# Altium schematic sheet Holder_Accu_Simetric.SchDoc
size A4; SheetNumber: 1; SheetTotal: 1
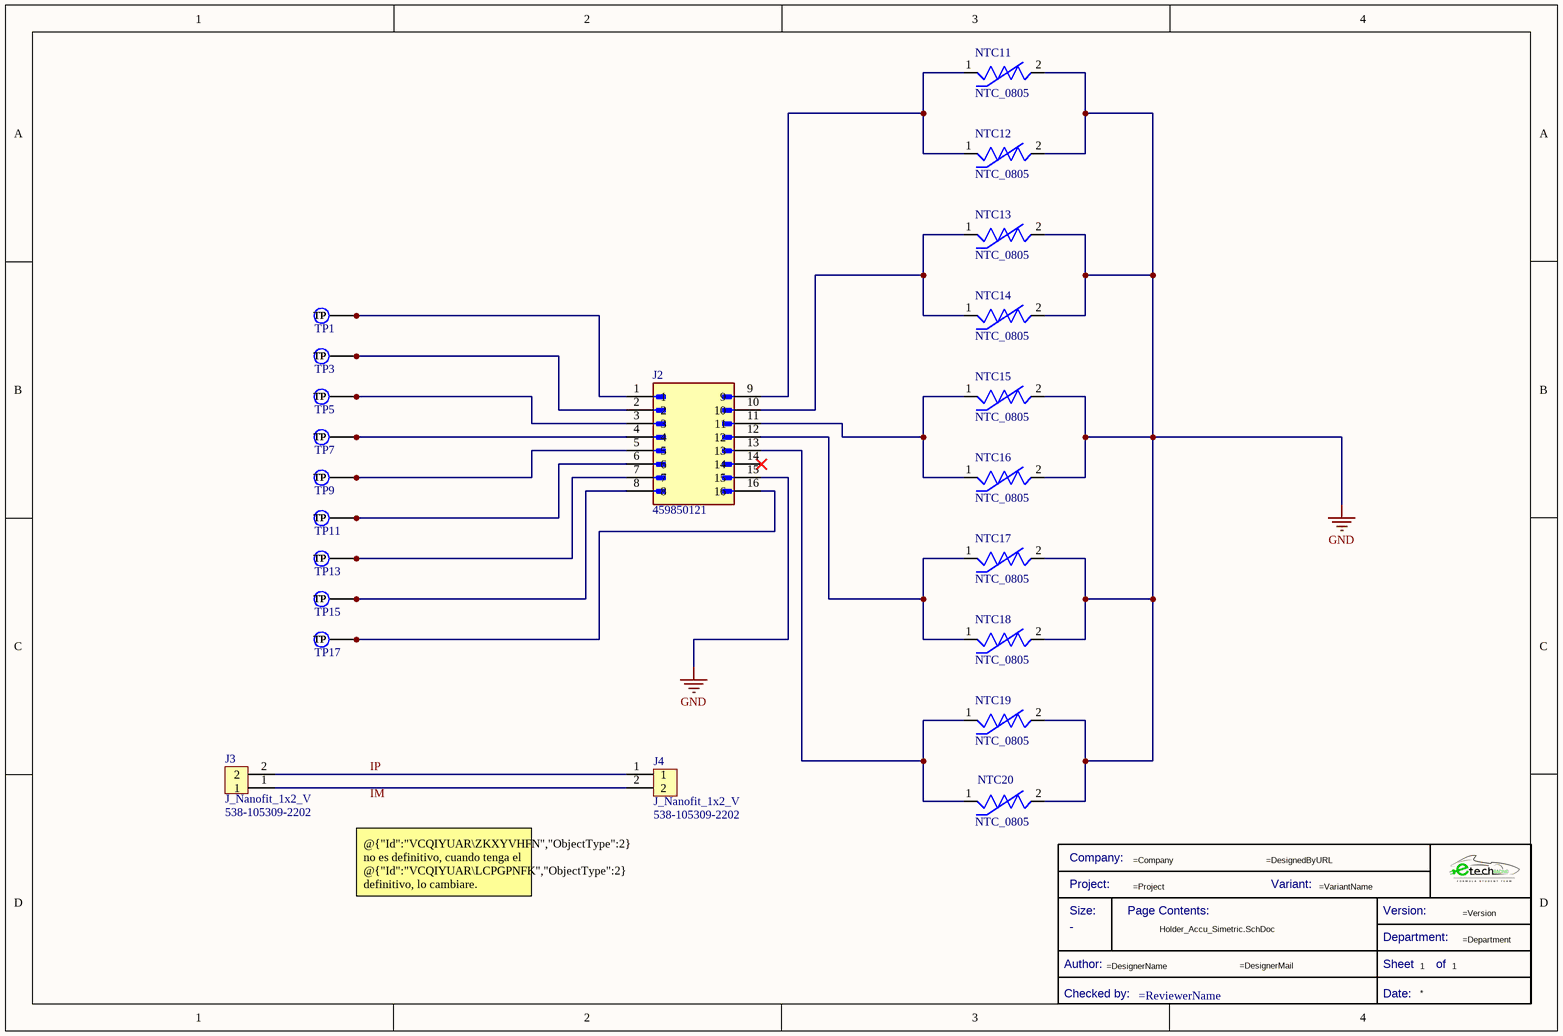
[diagram p0: Holder_Accu_Simetric.SchDoc]

## Parts
*  Title Block_template  (value not drawn)  (graphical)
J2  459850121  [MOLEX_459850121]
J3  J_Nanofit_1x2_V  Supplier Part Number 1: 538-105309-2202  [J_NanoFit_1X2_V]
J4  J_Nanofit_1x2_V  Supplier Part Number 1: 538-105309-2202  [J_NanoFit_1X2_V]
NTC11  NTC_0805  [NTC_0805]
NTC12  NTC_0805  [NTC_0805]
NTC13  NTC_0805  [NTC_0805]
NTC14  NTC_0805  [NTC_0805]
NTC15  NTC_0805  [NTC_0805]
NTC16  NTC_0805  [NTC_0805]
NTC17  NTC_0805  [NTC_0805]
NTC18  NTC_0805  [NTC_0805]
NTC19  NTC_0805  [NTC_0805]
NTC20  NTC_0805  [NTC_0805]
TP1  Test Point  [TESTPOINT_WIDE]  (value not drawn)
TP3  Test Point  [TESTPOINT_WIDE]  (value not drawn)
TP5  Test Point  [TESTPOINT_WIDE]  (value not drawn)
TP7  Test Point  [TESTPOINT_WIDE]  (value not drawn)
TP9  Test Point  [TESTPOINT_WIDE]  (value not drawn)
TP11  Test Point  [TESTPOINT_WIDE]  (value not drawn)
TP13  Test Point  [TESTPOINT_WIDE]  (value not drawn)
TP15  Test Point  [TESTPOINT_WIDE]  (value not drawn)
TP17  Test Point  [TESTPOINT_WIDE]  (value not drawn)

## Nets
GND: J2.15 NTC11.2 NTC12.2 NTC13.2 NTC14.2 NTC15.2 NTC16.2 NTC17.2 NTC18.2 NTC19.2 NTC20.2
IP: J3.2 J4.1
NetJ2_1: J2.1 TP1.1(TP)
NetJ2_2: J2.2 TP3.1(TP)
NetJ2_3: J2.3 TP5.1(TP)
NetJ2_4: J2.4 TP7.1(TP)
NetJ2_5: J2.5 TP9.1(TP)
NetJ2_6: J2.6 TP11.1(TP)
NetJ2_7: J2.7 TP13.1(TP)
NetJ2_8: J2.8 TP15.1(TP)
NetJ2_9: J2.9 NTC11.1 NTC12.1
NetJ2_10: J2.10 NTC13.1 NTC14.1
NetJ2_11: J2.11 NTC15.1 NTC16.1
NetJ2_12: J2.12 NTC17.1 NTC18.1
NetJ2_13: J2.13 NTC19.1 NTC20.1
NetJ2_16: J2.16 TP17.1(TP)
NetJ3_1: J3.1 J4.2

Not connected (* = marked no-connect by the designer): J2 14*

## Notes on the sheet
- @{"Id":"VCQIYUAR\ZKXYVHFN","ObjectType":2} no es definitivo, cuando tenga el @{"Id":"VCQIYUAR\LCPGPNFK","ObjectType":2} definitivo, lo cambiare.
- Labels drawn without touching a wire or pin: IM
- (in symbol Title Block_template) Company:; Project:; Variant:; Size:; Page Contents:; Version:; Department:; Author:; Sheet; of; Checked by:; Date:

## Library data of the parts
* = Title Block_template: Standard Title Block; .Creator: GP; Category: Title Block; .PCBcheck: GP; .SCHcheck: GP; Checked by:: =ReviewerName; Size: -
J3 J4 = J_Nanofit_1x2_V: Nano-Fit Vertical Header, Through Hole, 2.50mm Pitch, Single Row, 2 Circuits, with Kinked Pins, Tin (Sn) Plating,...; Manufacturer: Molex; Manufacturer Part Number: 1053092202; Supplier 1: Mouser; RoHS: No; Stock 1: 6299; Pricing 1: 1=1,09, 10=0,839, 50=0,839, 100=0,686, 1000=0,571, 10000=0,507 (USD)
NTC11-NTC20 = NTC_0805: NTC Thermistor 10k 0805 (2012 Metric); MF: TDK Corporation; MP: NTCG203NH103JTDS; SnapEDA_Link: https://www.snapeda.com/parts/NTCG203NH103JTDS/TDK/view-part/?ref=snap; Package: 0805 TDK; Value: *; Check_prices: https://www.snapeda.com/parts/NTCG203NH103JTDS/TDK/view-part/?ref=eda
TP1 TP3 TP5 TP7 TP9 TP11 TP13 TP15 TP17 = TestPoint_Wide: TestPoint 5x5mm
J2 = 459850121: Price: None; MP: 459850121; Value: *; Availability: Unavailable; Package: None